# EAGLE design store-row-select (EAGLE 7.3.0)
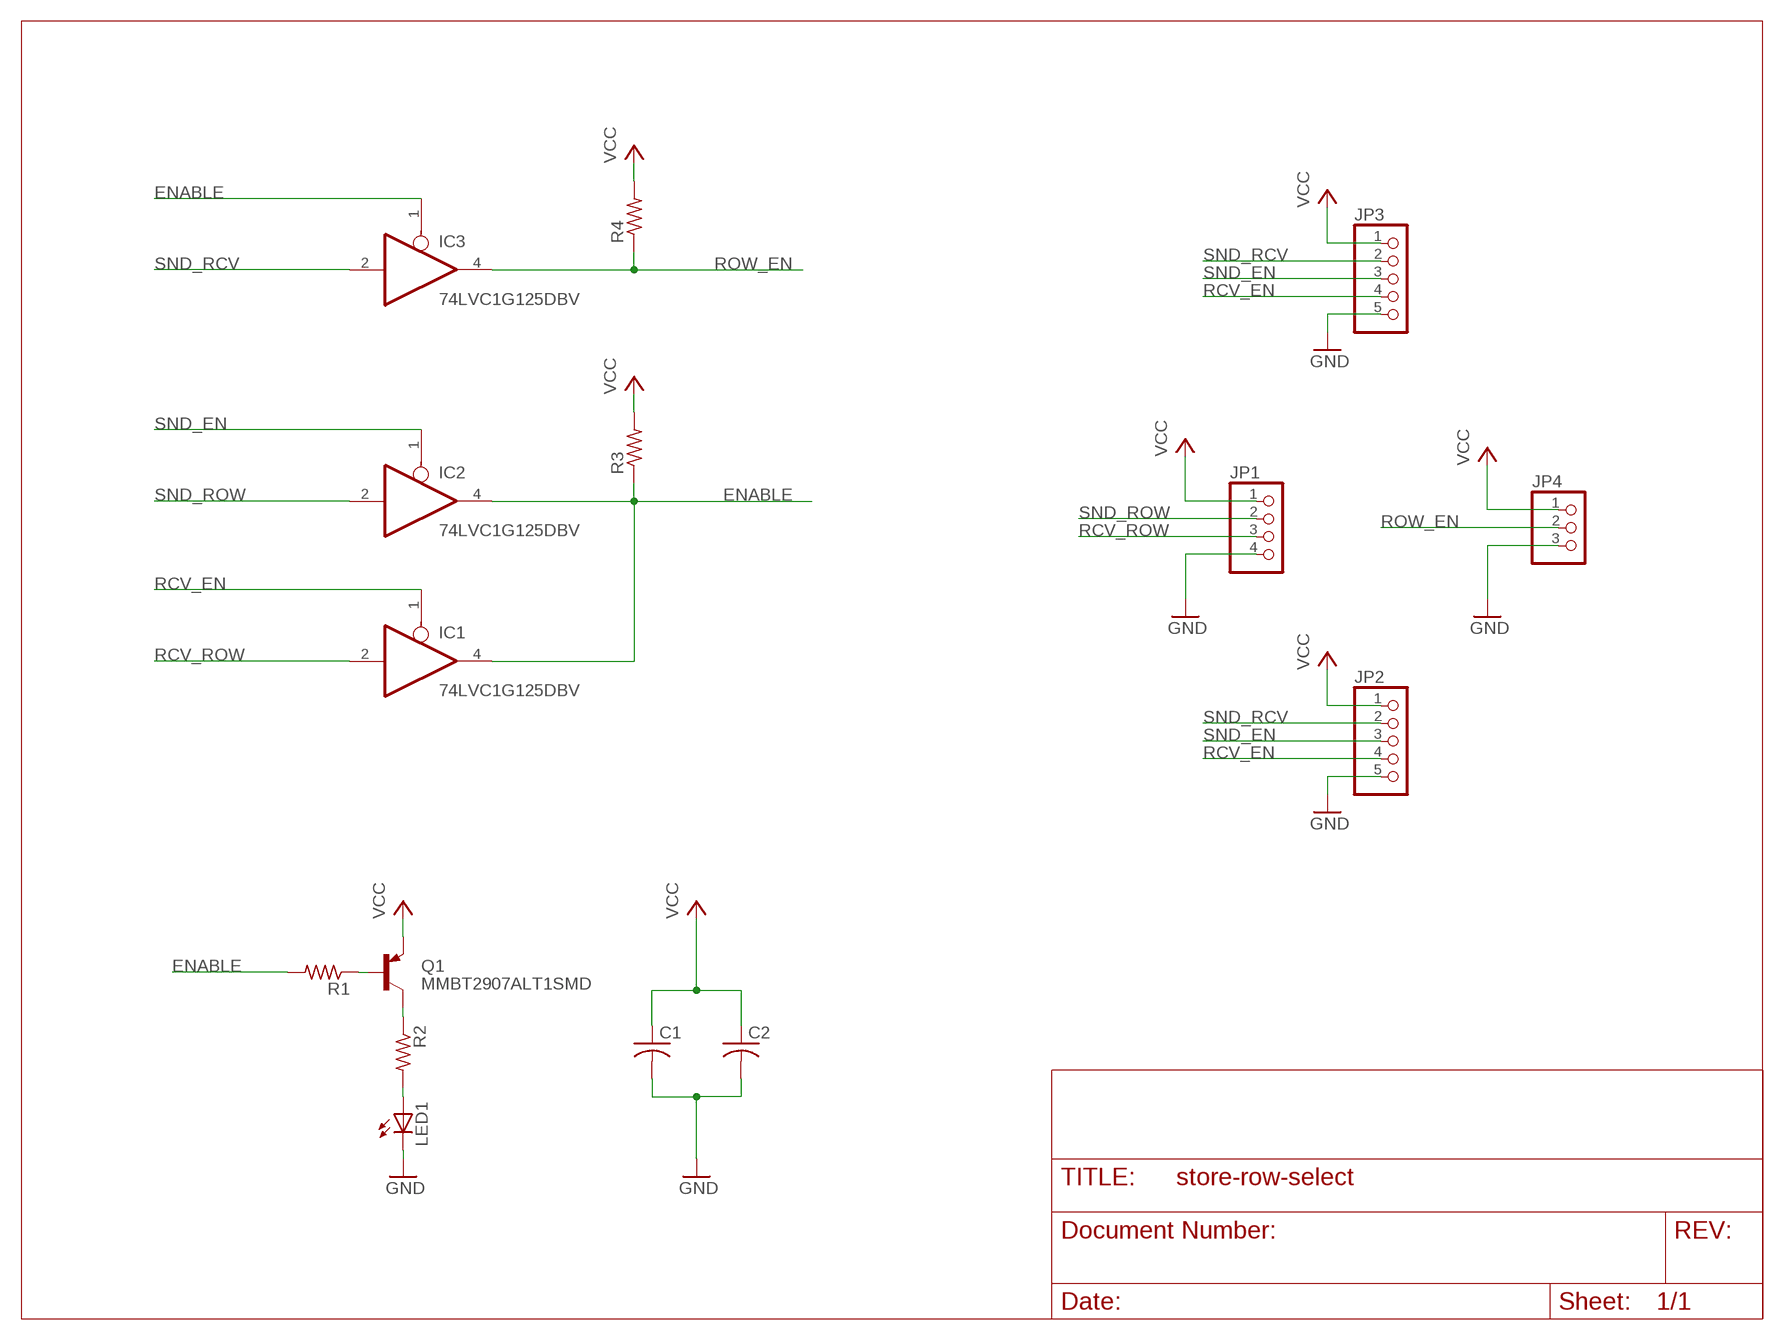
[diagram p0: schematic, sheet 1]

## Parts
C1  C-USC0805  [C0805]
C2  C-USC0805  [C0805]
IC1  74LVC1G125DBV  [SOT23-5]
IC2  74LVC1G125DBV  [SOT23-5]
IC3  74LVC1G125DBV  [SOT23-5]
JP1  PINHD-1X4  [1X04]
JP2  PINHD-1X5  [1X05]
JP3  PINHD-1X5  [1X05]
JP4  PINHD-1X3  [1X03]
LED1  LEDCHIP-LED0805  [CHIP-LED0805]
Q1  MMBT2907ALT1SMD  [SOT23-BEC]
R1  R-US_R0805  [R0805]
R2  R-US_R0805  [R0805]
R3  R-US_R0805  [R0805]
R4  R-US_R0805  [R0805]

## Nets
ENABLE: IC1.4(O) IC2.4(O) IC3.1(OE) R1.2 R3.1
GND: C1.2 C2.2 JP1.4 JP2.5 JP3.5 JP4.3 LED1.C
N$2: Q1.B R1.1
N$4: Q1.C R2.1
N$5: LED1.A R2.2
RCV_EN: IC1.1(OE) JP2.4 JP3.4
RCV_ROW: IC1.2(I) JP1.3
ROW_EN: IC3.4(O) JP4.2 R4.1
SND_EN: IC2.1(OE) JP2.3 JP3.3
SND_RCV: IC3.2(I) JP2.2 JP3.2
SND_ROW: IC2.2(I) JP1.2
VCC: C1.1 C2.1 JP1.1 JP2.1 JP3.1 JP4.1 Q1.E R3.2 R4.2

## Power pins joined to a net without a drawn wire
GND: IC1.3(GND) IC2.3(GND) IC3.3(GND)
VCC: IC1.5(VCC) IC2.5(VCC) IC3.5(VCC)

## Library data of the parts
C1 C2 = resistor:C-US: CAPACITOR, American symbol
IC1-IC3 = 74xx-little-us:74*1G125: Single Bus Buffer Gate with 3-State Output
JP1 = pinhead:PINHD-1X4: PIN HEADER
JP2 JP3 = pinhead:PINHD-1X5: PIN HEADER
JP4 = pinhead:PINHD-1X3: PIN HEADER
LED1 = led:LED: LED OSRAM: - CHIPLED LG R971, LG N971, LY N971, LG Q971, LY Q971, LO R971, LY R971 LH N974, LH R974 LS Q976, LO Q976, LY Q976 LO Q996 - Hyper CHIPLED LW Q18S LB Q993, LB Q99A, LB R99A - SideLED LS A670, LO A670, LY A670, LG A670, LP A670 LB A673, LV A673, LT A673, LW A673 LH A674 LY A675 LS A676, LA A676, LO A676, LY A676, LW A676 LS A679, LY A679, LG A679 - Hyper Micro SIDELED® LS Y876, LA Y876, LO Y876, LY Y876 LT Y87S - SmartLED LW L88C, LW L88S LB L89C, LB L89S, LG L890 LS L89K, LO L89K, LY L89K LS L896, LA L896, LO L896, LY L896 - TOPLED LS T670, LO T670, LY T670, LG T670, LP T670 LSG T670, LSP T670, LSY T670, LOP T670, LYG T670 LG T671, LOG T671, LSG T671 LB T673, LV T673, LT T673, LW T673 LH T674 LS T676, LA T676, LO T676, LY T676, LB T676, LH T676, LSB T676, LW T676 LB T67C, LV T67C, LT T67C, LS T67K, LO T67K, LY T67K, LW E67C LS E67B, LA E67B, LO E67B, LY E67B, LB E67C, LV E67C, LT E67C LW T67C LS T679, LY T679, LG T679 LS T770, LO T770, LY T770, LG T770, LP T770 LB T773, LV T773, LT T773, LW T773 LH T774 LS E675, LA E675, LY E675, LS T675 LS T776, LA T776, LO T776, LY T776, LB T776 LHGB T686 LT T68C, LB T68C - Hyper Mini TOPLED® LB M676 - Mini TOPLED Santana® LG M470 LS M47K, LO M47K, LY M47K Source: http://www.osram.convergy.de LUXEON: - LUMILED® LXK2-PW12-R00, LXK2-PW12-S00, LXK2-PW14-U00, LXK2-PW14-V00 LXK2-PM12-R00, LXK2-PM12-S00, LXK2-PM14-U00 LXK2-PE12-Q00, LXK2-PE12-R00, LXK2-PE12-S00, LXK2-PE14-T00, LXK2-PE14-U00 LXK2-PB12-K00, LXK2-PB12-L00, LXK2-PB12-M00, LXK2-PB14-N00, LXK2-PB14-P00, LXK2-PB14-Q00 LXK2-PR12-L00, LXK2-PR12-M00, LXK2-PR14-Q00, LXK2-PR14-R00 LXK2-PD12-Q00, LXK2-PD12-R00, LXK2-PD12-S00 LXK2-PH12-R00, LXK2-PH12-S00 LXK2-PL12-P00, LXK2-PL12-Q00, LXK2-PL12-R00 Source: www.luxeon.com KINGBRIGHT: KA-3528ASYC Source: www.kingbright.com
Q1 = transistor-pnp:MMBT2907*: PNP Transistror
R1-R4 = resistor:R-US_: RESISTOR, American symbol

## Board
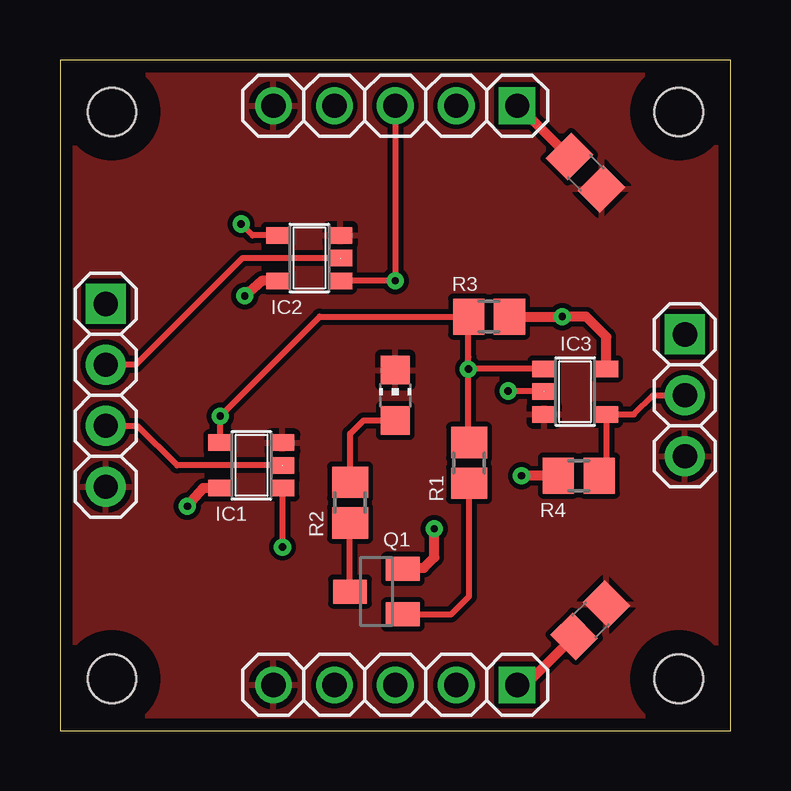
[diagram p1: board, top side]
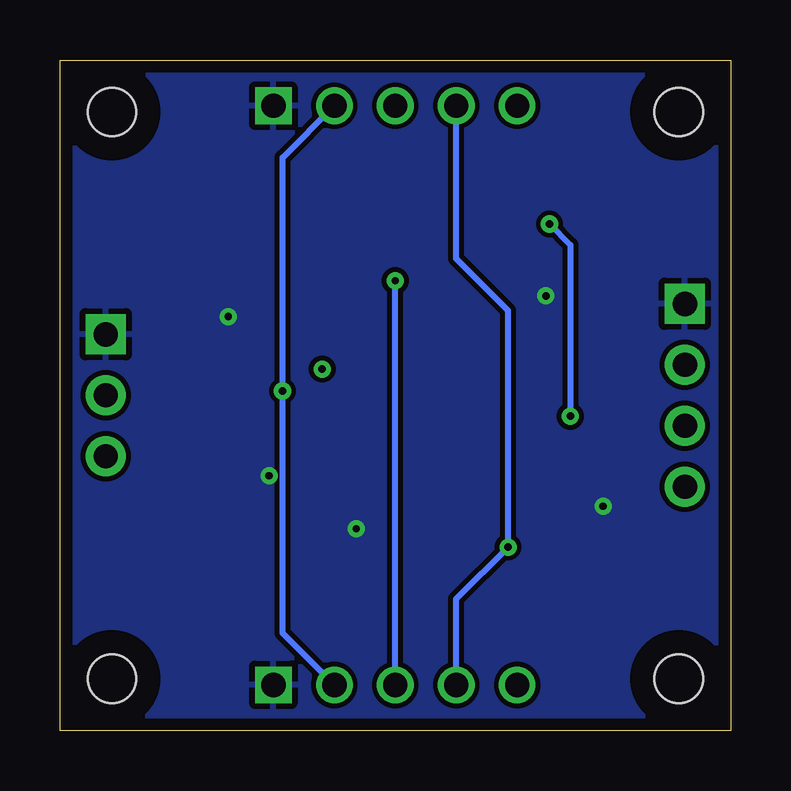
[diagram p2: board, bottom side, seen from below]

Size 27.94 x 27.94 mm. Coordinates in mm from the lower left corner, seen from the top.
Outline: 27.94,0 27.94,27.94 0,27.94 0,0 27.94,0
Copper layers (1*16): Top 0.035mm / dielectric 1.5mm / Bottom 0.035mm
Design rules "default *": minimum track width 8mil, minimum drill 12mil, track to track 8mil, track to pad 8mil, pad to pad 8mil, via to via 8mil, smd to smd 8mil, copper to edge 20mil, drill to drill 8mil, minimum pad ring 10mil, minimum via ring 8mil, stop-mask expansion 4mil, vias tented up to drill 0mil, thermal gap 10mil
Holes 2.01 mm at 2.16,25.78 2.16,2.16 25.78,2.16 25.78,25.78
tRestrict: area 0.2,0.2 to 4.2,4.2; area 23.8,0.2 to 27.8,4.2; area 23.8,23.8 to 27.8,27.8; area 0.2,23.8 to 4.2,27.8
bRestrict: area 0.2,0.2 to 4.2,4.2; area 23.8,0.2 to 27.8,4.2; area 23.8,23.8 to 27.8,27.8; area 0.2,23.8 to 4.2,27.8

### Footprints (pad centres in the part's own frame; a part is rotated, then mirrored left to right if it is on the bottom)
C0805 = smd 1.3 x 1.5: 1 -0.95,0; 2 0.95,0
SOT23-5 = smd 0.69 x 0.99: 1 -0.95,-1.29; 2 0,-1.29; 3 0.95,-1.29; 4 0.95,1.3; 5 -0.95,1.3
1X04 = drill 1.016 pad 1.676 square: 1 -3.81,0 | drill 1.016 pad 1.676: 2 -1.27,0; 3 1.27,0; 4 3.81,0
1X05 = drill 1.016 square: 1 -5.08,0 | drill 1.016: 2 -2.54,0; 3 0,0; 4 2.54,0; 5 5.08,0
1X03 = drill 1.016 pad 1.676 square: 1 -2.54,0 | drill 1.016 pad 1.676: 2 0,0; 3 2.54,0
CHIP-LED0805 = smd 1.2 x 1.2: A 0,-1.05; C 0,1.05
SOT23-BEC = smd 1 x 1.4: B -0.95,-1.1; C 0,1.1; E 0.95,-1.1
R0805 = smd 1.3 x 1.5: 1 -0.85,0; 2 0.85,0

### Placement (x,y rotation side)
C1  21.89,23.24 315 top
C2  22.1,4.6 45 top
IC1  7.98,11.05 90 top
IC2  10.39,19.68 90 top
IC3  21.46,14.12 270 top
JP1  1.91,13.97 270 top
JP2  13.97,1.91 180 top
JP3  13.97,26.04 180 top
JP4  26.04,13.97 270 top
LED1  13.97,13.97 0 top
Q1  13.18,5.79 90 top
R1  17.04,11.15 90 top
R2  12.09,9.5 90 top
R3  17.88,17.25 0 top
R4  21.62,10.62 180 top

### Tracks (layer width: path | path; a pad name or v marks a point on that pad's centre or on a via)
ENABLE  (via drill 0.3)
  Top 0.254: IC1.4 v6.68,13.1 10.82,17.25 R3.1 17.02,17.23 17.02,15.57 v17.02,15.06 | IC2.4 8.02,20.64 v7.54,21.11 | R1.2 17.02,12.03 v17.02,15.06 | IC3.1 17.03,15.07 v17.02,15.06
  Bottom 0.254: v7.54,21.11 6.68,20.24 v6.68,13.1
GND
  pour Top: 0.25,0.25 0.25,27.69 27.69,27.69 27.69,0.25
N$2
  Top 0.254: Q1.B 16.3,4.84 17.04,5.59 R1.1
N$4
  Top 0.254: Q1.C R2.1
N$5
  Top 0.254: 14.04,12.99 LED1.A 12.65,12.93 12.09,12.37 R2.2
RCV_EN  (via drill 0.3)
  Top 0.254: 9.17,10 IC1.1 v9.27,7.64
  Bottom 0.254: JP2.4 11.43,5.49 v9.27,7.64 9.27,17.5 11.43,19.66 JP3.4
RCV_ROW
  Top 0.254: IC1.2 4.88,11.05 3.23,12.7 JP1.3
ROW_EN
  Top 0.254: JP4.2 24.71,13.97 23.92,13.17 IC3.4 22.76,10.62 R4.1
SND_EN  (via drill 0.3)
  Top 0.254: IC2.1 11.69,18.75 v13.97,18.75 JP3.3
  Bottom 0.254: JP2.3 v13.97,18.75
SND_RCV  (via drill 0.3)
  Top 0.254: IC3.2 20.17,14.15 v18.67,14.15
  Bottom 0.254: JP2.2 18.67,4.06 v18.67,14.15 18.67,23.88 JP3.2
SND_ROW
  Top 0.254: IC2.2 7.59,19.68 3.15,15.24 JP1.2
VCC  (via drill 0.3)
  Top 0.406: IC1.5 5.96,10.1 v5.31,9.35 | Q1.E arc45 14.3,6.78 15.17,6.78 15.6,7.21 v15.6,8.41 | IC2.5 8.4,18.73 v7.7,18.11 | R3.2 v20.93,17.25 21.92,17.25 22.76,16.4 IC3.5 | JP2.1 19.41,1.91 C2.1 | JP3.1 19.1,26.04 C1.1 | R4.2 v19.23,10.62
  pour Bottom: 0.25,27.69 0.25,0.25 27.69,0.25 27.69,27.69

### Text on the board
Document: SEL | ROW / SELECT